# EAGLE board CntrlBoardV3 (EAGLE 8.3.1)
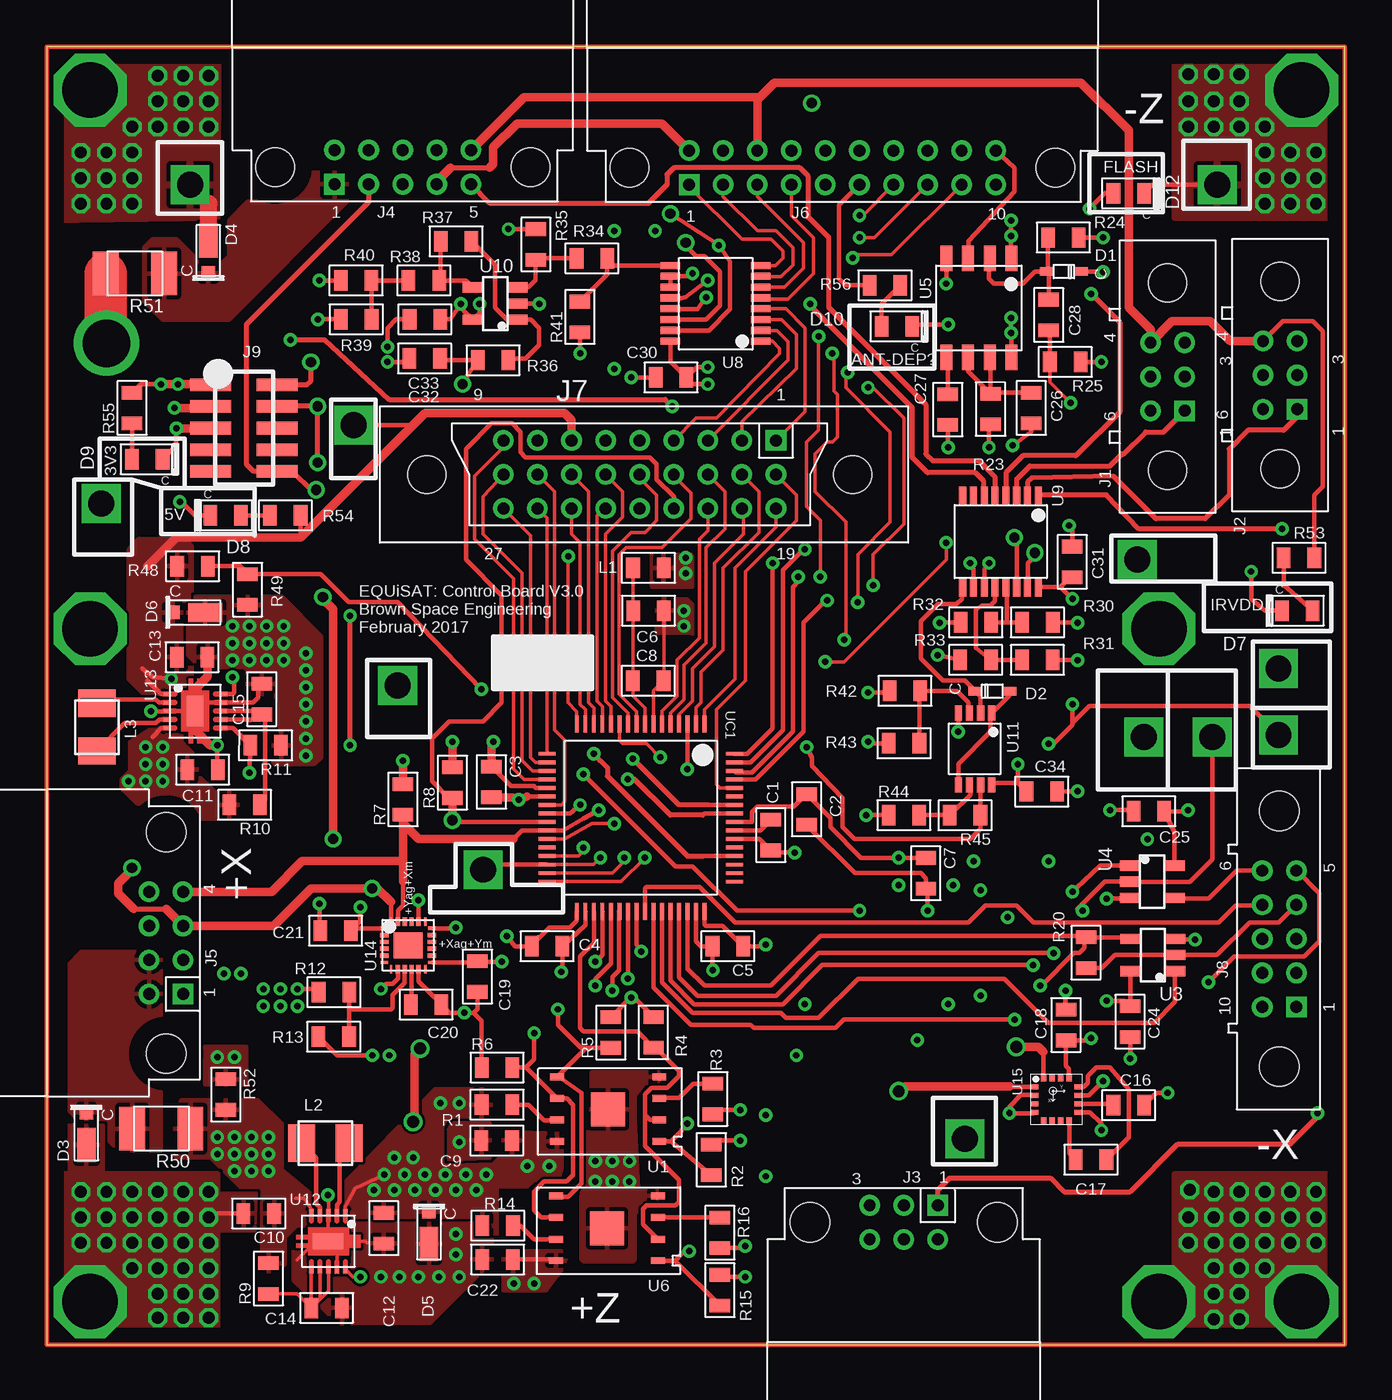
[diagram p8: board, top side]
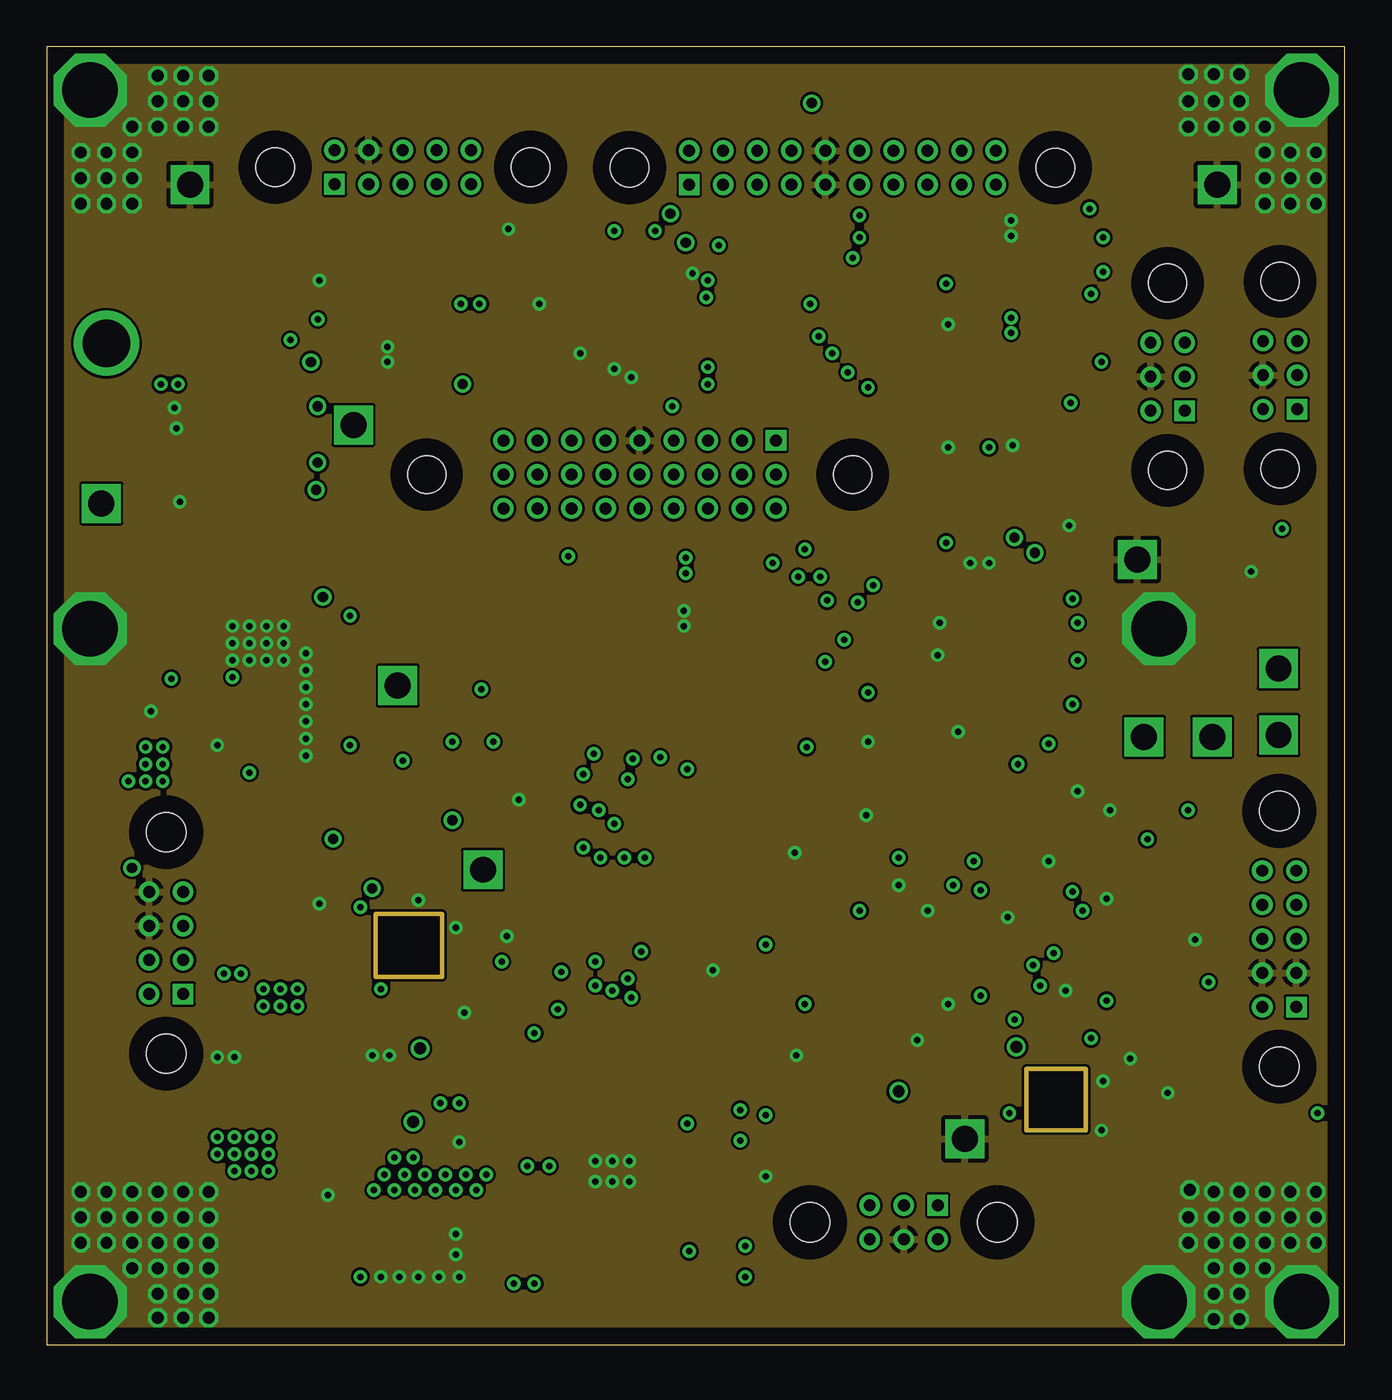
[diagram p9: board, inner layer Route2]
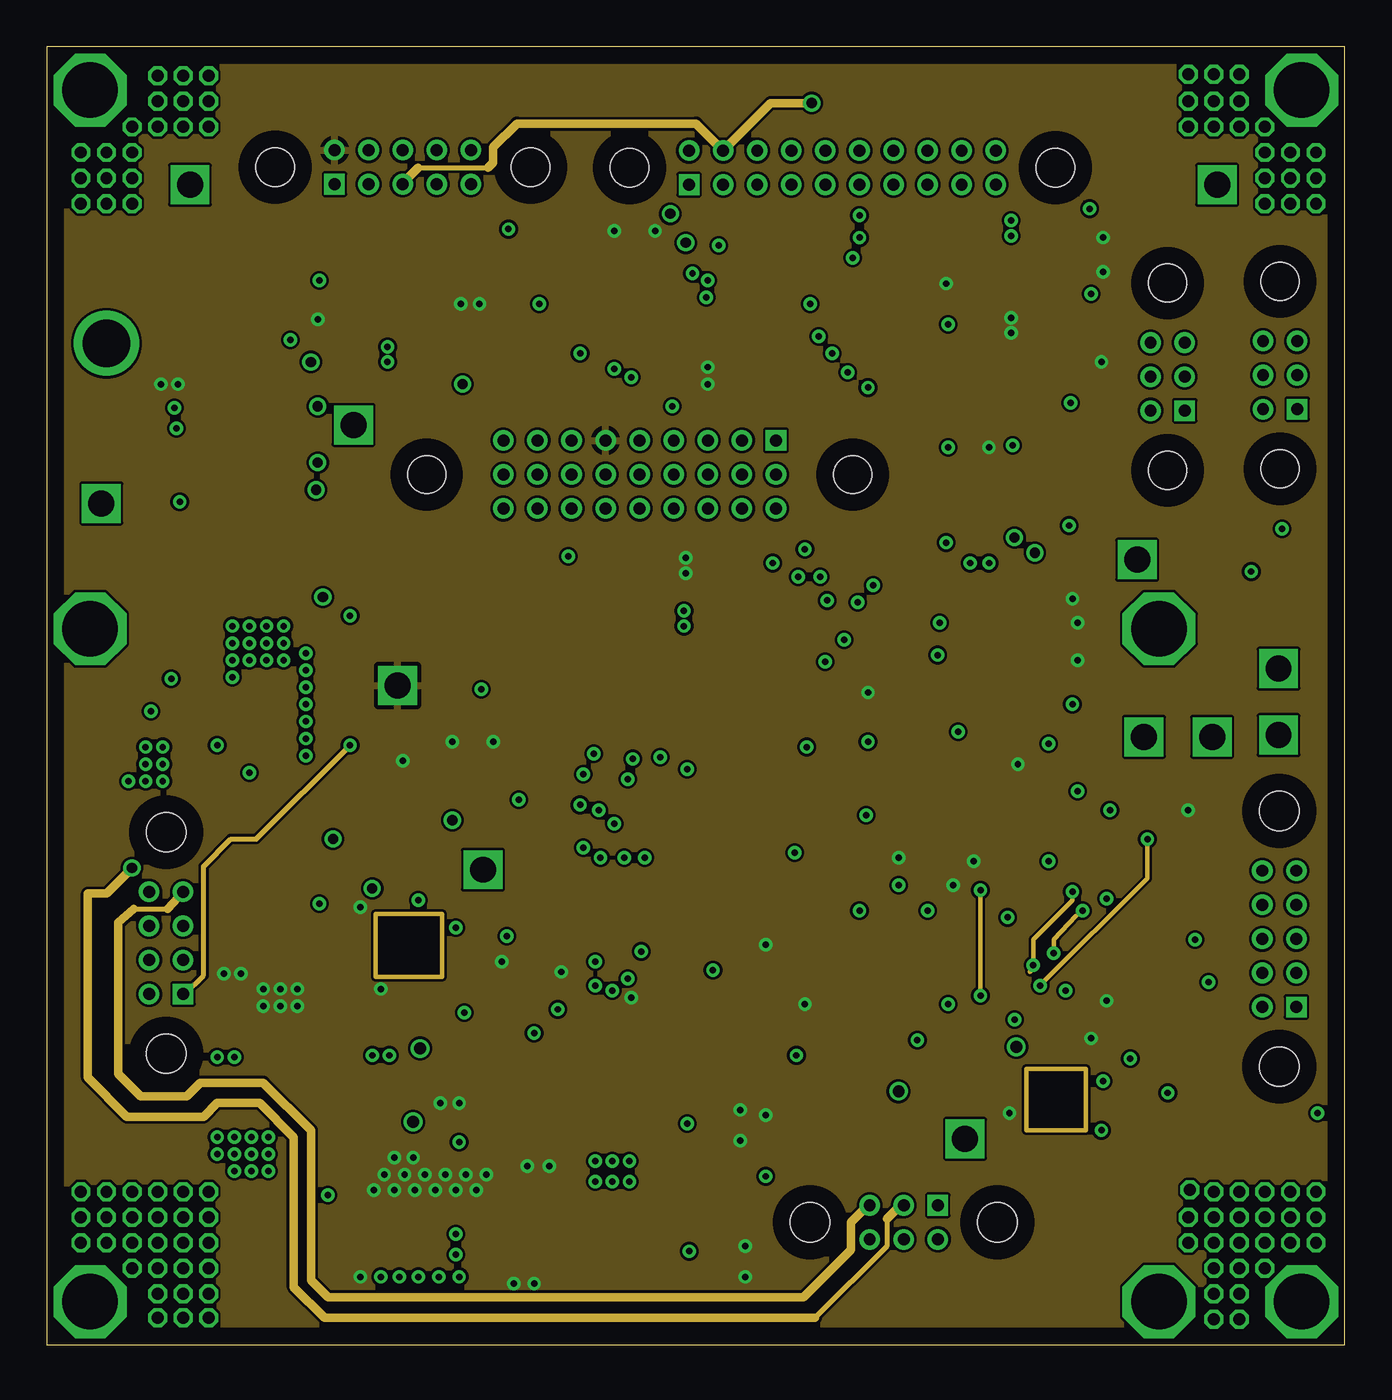
[diagram p10: board, inner layer Route3]
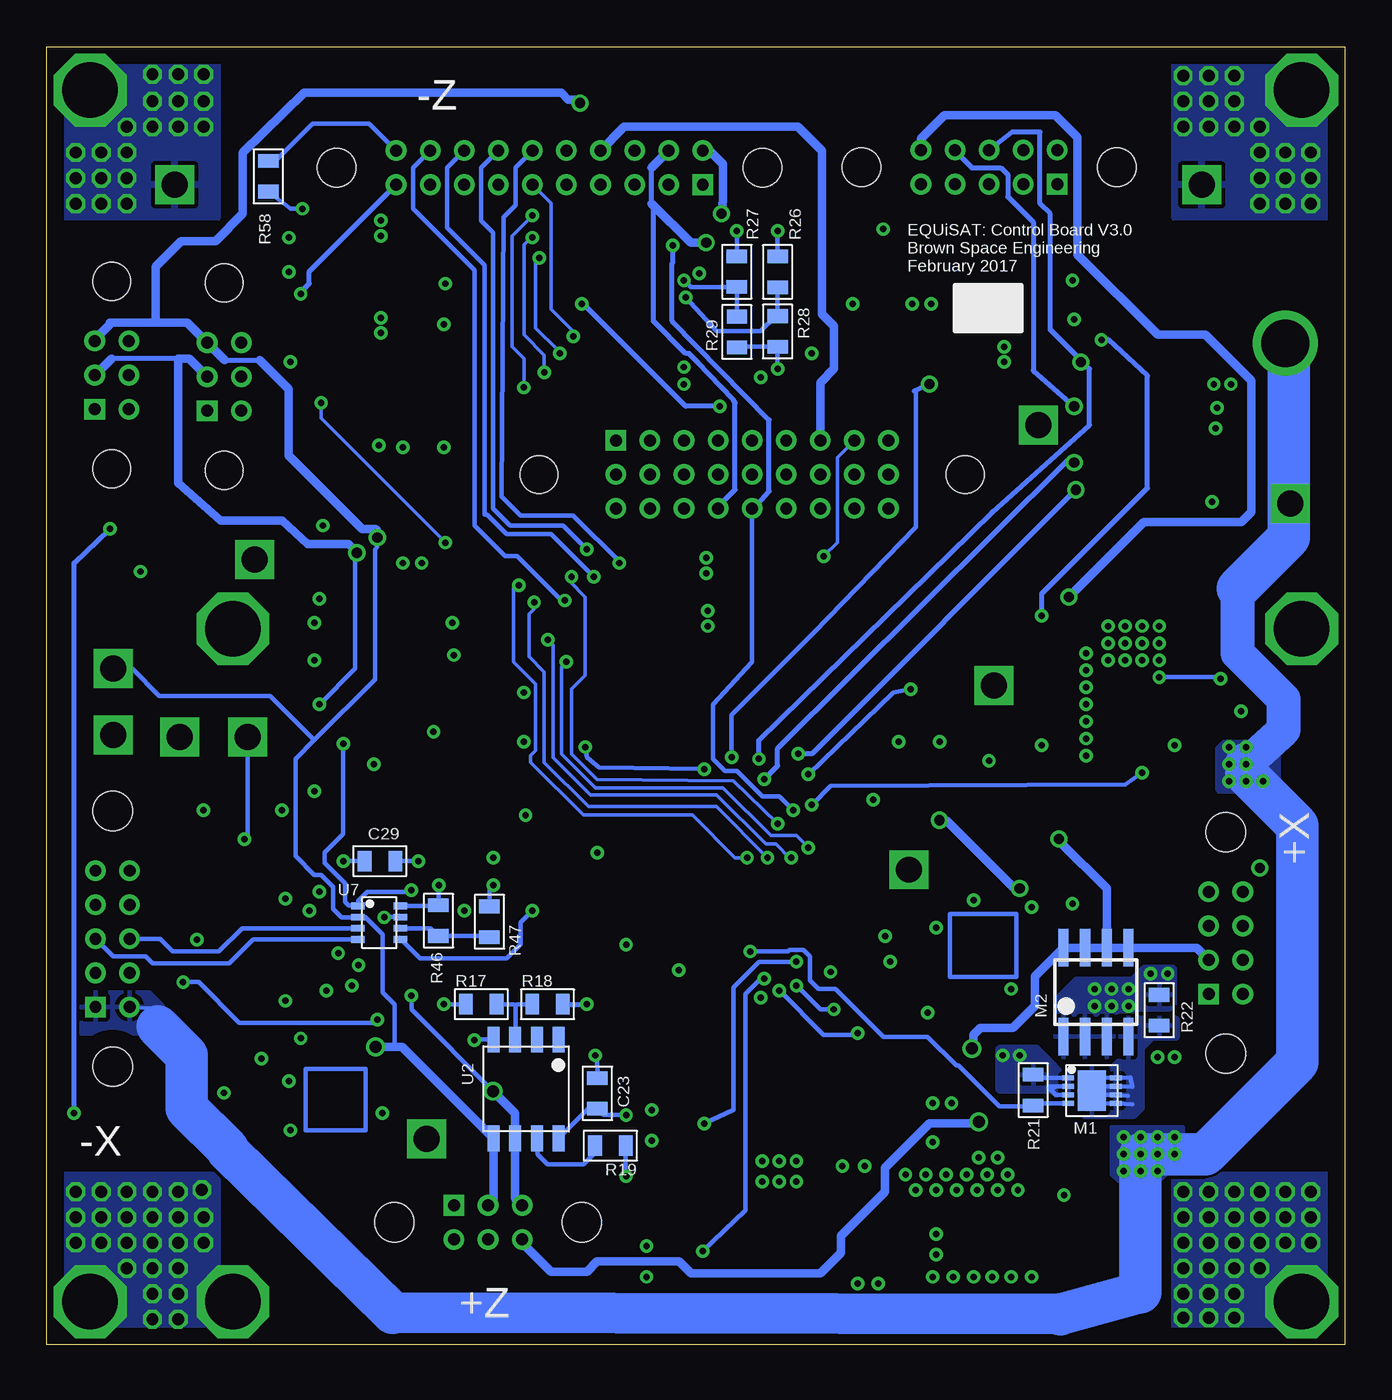
[diagram p11: board, bottom side, seen from below]

Size 76.2 x 76.2 mm. Coordinates in mm from the lower left corner, seen from the top.
Outline: 0,0 76.2,0 76.2,76.2 0,76.2 0,0
Copper layers (1*2*3*16): Top 0.035mm / dielectric 0.2mm / Route2 0.035mm / dielectric 0.2mm / Route3 0.035mm / dielectric 0.2mm / Bottom 0.035mm
Design rules "default *": minimum track width 6mil, minimum drill 15mil, track to track 6mil, track to pad 6mil, pad to pad 6mil, via to via 6mil, smd to smd 6mil, copper to edge 40mil, drill to drill 8mil, minimum pad ring 10mil, minimum via ring 8mil, stop-mask expansion 1mil, vias tented up to drill 0mil, thermal gap 10mil

## Footprints (pad centres in the part's own frame; a part is rotated, then mirrored left to right if it is on the bottom)
0805 = smd 0.8 x 1.2: 1 -0.9,0; 2 0.9,0
SOD-523F = smd 0.5 x 0.8: A 0,-1; C 0,1
MICROSMP = smd 2 x 1.1: A -1.3,0 | smd 0.8 x 0.8: C 0.6,0
0805-D = smd 0.8 x 1.2: A -0.9,0; C 0.9,0
HARWIN_DATAMATE_6 = drill 0.7 square: P$1 -2,-1 | drill 0.7: P$2 0,-1; P$3 2,-1; P$4 2,1; P$5 0,1; P$6 -2,1 | hole 2.2: -5.5,0; 5.5,0
M80-54006 = drill 0.7 square: P$1 0,0 | drill 0.7: P$2 2,0; P$3 4,0; P$4 4,2; P$5 2,2; P$6 0,2 | hole 2.3: -3.5,1; 7.5,1
M80-54010 = drill 0.7 square: P$1 0,0 | drill 0.7: P$2 2,0; P$3 4,0; P$4 6,0; P$5 8,0; P$6 8,2; P$7 6,2; P$8 4,2; P$9 2,2; P$10 0,2 | hole 2.25: -3.5,1; 11.5,1
M80-54008 = drill 0.7 square: P$1 0,0 | drill 0.7: P$2 2,0; P$3 4,0; P$4 6,0; P$5 6,2; P$6 4,2; P$7 2,2; P$8 0,2 | hole 2.3: -3.5,1; 9.5,1
M80-54020 = drill 0.7 square: P$1 -9,-1 | drill 0.7: P$2 -7,-1; P$3 -5,-1; P$4 -3,-1; P$5 -1,-1; P$6 1,-1; P$7 3,-1; P$8 5,-1; P$9 7,-1; P$10 9,-1; P$11 9,1; P$12 7,1; P$13 5,1; P$14 3,1; P$15 1,1; P$16 -1,1; P$17 -3,1; P$18 -5,1; P$19 -7,1; P$20 -9,1 | hole 2.25: -12.5,0; 12.5,0
M83-LMT1M2N27 = drill 0.7 square: P$1 0,0 | drill 0.7: P$2 -2,0; P$3 -4,0; P$4 -6,0; P$5 -8,0; P$6 -10,0; P$7 -12,0; P$8 -14,0; P$9 -16,0; P$10 -16,-2; P$11 -14,-2; P$12 -12,-2; P$13 -10,-2; P$14 -8,-2; P$15 -6,-2; P$16 -4,-2; P$17 -2,-2; P$18 0,-2; P$19 0,-4; P$20 -2,-4; P$21 -4,-4; P$22 -6,-4; P$23 -8,-4; P$24 -10,-4; P$25 -12,-4; P$26 -14,-4; P$27 -16,-4 | hole 2.2: 4.5,-2; -20.5,-2
M80-510 = drill 0.7 square: P$1 0,0 | drill 0.7: P$2 2,0; P$3 4,0; P$4 6,0; P$5 8,0; P$6 8,2; P$7 6,2; P$8 4,2; P$9 2,2; P$10 0,2 | hole 2.3: 11.5,1; -3.5,1
10PINMALE = smd 0.74 x 2.4: P1 -2.54,-1.95; P2 -1.27,-1.95; P3 0,-1.95; P4 1.27,-1.95; P5 2.54,-1.95; P6 2.54,1.95; P7 1.27,1.95; P8 0,1.95; P9 -1.27,1.95; P10 -2.54,1.95
L3225M = smd 1.6 x 2.2: 1 -1.4,0; 2 1.4,0
DFN-3X3-8 = smd 0.3 x 0.7: P$1 -0.75,-1.25; P$2 -0.25,-1.25; P$3 0.25,-1.25; P$4 0.75,-1.25; P$5 0.75,1.55; P$6 0.25,1.55; P$7 -0.25,1.55; P$8 -0.75,1.55 | smd 2.38 x 1.65: PAD 0,0.15
SO08 = smd 0.6 x 2.2: 1 -1.905,-2.6; 2 -0.635,-2.6; 3 0.635,-2.6; 4 1.905,-2.6; 5 1.905,2.6; 6 0.635,2.6; 7 -0.635,2.6; 8 -1.905,2.6
1210 = smd 1.52 x 2.54: P$1 -1.71,0 | smd 1.51 x 2.54: P$2 1.71,0
8PXMO-229 = smd 0.813 x 0.406: P1 -3,1.895; P2 -3,0.635; P3 -3,-0.635; P4 -3,-1.895; P5 3,-1.895; P6 3,-0.635; P7 3,0.635; P8 3,1.895 | smd 2 x 2: P9 0,0
SO-8 = smd 0.7 x 1.5: P$1 -1.905,-2.9; P$2 -0.635,-2.9; P$3 0.635,-2.9; P$4 1.905,-2.9; P$5 1.905,2.9; P$6 0.635,2.9; P$7 -0.635,2.9; P$8 -1.905,2.9
TSOT23-5 = smd 0.6 x 1.2: P$1 -0.95,-1.306; P$2 0,-1.306; P$3 0.95,-1.306; P$4 0.95,1.306; P$5 -0.95,1.306
SOT-23-8 = smd 0.4 x 0.8: P$1 -1.016,-1.27; P$2 -0.366,-1.27; P$3 0.284,-1.27; P$4 0.934,-1.27; P$5 0.934,1.23; P$6 0.284,1.23; P$7 -0.366,1.23; P$8 -1.016,1.23
SSOP-16-NARROW = smd 0.419 x 1.143: P$1 0,0; P$2 0.635,0; P$3 1.27,0; P$4 1.905,0; P$5 2.54,0; P$6 3.175,0; P$7 3.81,0; P$8 4.445,0; P$9 4.445,5.309; P$10 3.81,5.309; P$11 3.175,5.309; P$12 2.54,5.309; P$13 1.905,5.309; P$14 1.27,5.309; P$15 0.635,5.309; P$16 0,5.309
MSOP-8 = smd 0.42 x 0.89: P$1 0,0; P$2 0.65,0; P$3 1.3,0; P$4 1.95,0; P$5 1.95,4.21; P$6 1.3,4.21; P$7 0.65,4.21; P$8 0,4.21
QFN10_POWERPAD = smd 0.203 x 0.406: P$1 0.14,0.241; P$2 0.641,0.241; P$3 1.141,0.242; P$4 1.639,0.239; P$5 2.139,0.242; P$6 2.14,3.559; P$7 1.639,3.559; P$8 1.139,3.555; P$9 0.641,3.555; P$10 0.139,3.558 | smd 1.778 x 0.914: PAD 1.155,1.898
QFN-24-3X3 = smd 0.5 x 0.2: 1 -1.4,1; 6 -1.4,-1; 13 1.4,-1; 18 1.4,1 | smd 0.5 x 0.25: 2 -1.4,0.6; 3 -1.4,0.2; 4 -1.4,-0.2; 5 -1.4,-0.6; 14 1.4,-0.6; 15 1.4,-0.2; 16 1.4,0.2; 17 1.4,0.6 | smd 0.2 x 0.5: 7 -1,-1.4; 12 1,-1.4; 19 1,1.4; 24 -1,1.4 | smd 0.25 x 0.5: 8 -0.6,-1.4; 9 -0.2,-1.4; 10 0.2,-1.4; 11 0.6,-1.4; 20 0.6,1.4; 21 0.2,1.4; 22 -0.2,1.4; 23 -0.6,1.4 | smd 1.7 x 1.54: P 0,0
HMC5883L = smd 0.45 x 0.3: 1 0.225,2.25; 2 0.225,1.75; 3 0.225,1.25; 4 0.225,0.75; 9 2.775,0.75; 10 2.775,1.25; 11 2.775,1.75; 12 2.775,2.25 | smd 0.3 x 0.45: 5 0.75,0.225; 6 1.25,0.225; 7 1.75,0.225; 8 2.25,0.225; 13 2.25,2.775; 14 1.75,2.775; 15 1.25,2.775; 16 0.75,2.775
TQFP-64 = smd 1 x 0.22: P$1 -5.5,3.5; P$2 -5.5,3; P$3 -5.5,2.5; P$4 -5.5,2; P$5 -5.5,1.5; P$6 -5.5,1; P$7 -5.5,0.5; P$8 -5.5,0; P$9 -5.5,-0.5; P$10 -5.5,-1; P$11 -5.5,-1.5; P$12 -5.5,-2; P$13 -5.5,-2.5; P$14 -5.5,-3; P$15 -5.5,-3.5; P$16 -5.5,-4; P$33 5.5,-4; P$34 5.5,-3.5; P$35 5.5,-3; P$36 5.5,-2.5; P$37 5.5,-2; P$38 5.5,-1.5; P$39 5.5,-1; P$40 5.5,-0.5; P$41 5.5,0; P$42 5.5,0.5; P$43 5.5,1; P$44 5.5,1.5; P$45 5.5,2; P$46 5.5,2.5; P$47 5.5,3; P$48 5.5,3.5 | smd 0.22 x 1: P$17 -3.75,-5.75; P$18 -3.25,-5.75; P$19 -2.75,-5.75; P$20 -2.25,-5.75; P$21 -1.75,-5.75; P$22 -1.25,-5.75; P$23 -0.75,-5.75; P$24 -0.25,-5.75; P$25 0.25,-5.75; P$26 0.75,-5.75; P$27 1.25,-5.75; P$28 1.75,-5.75; P$29 2.25,-5.75; P$30 2.75,-5.75; P$31 3.25,-5.75; P$32 3.75,-5.75; P$49 3.75,5.25; P$50 3.25,5.25; P$51 2.75,5.25; P$52 2.25,5.25; P$53 1.75,5.25; P$54 1.25,5.25; P$55 0.75,5.25; P$56 0.25,5.25; P$57 -0.25,5.25; P$58 -0.75,5.25; P$59 -1.25,5.25; P$60 -1.75,5.25; P$61 -2.25,5.25; P$62 -2.75,5.25; P$63 -3.25,5.25; P$64 -3.75,5.25
VIA-60MIL-SQ = drill 1.524 square: P$1 0,0

## Placement (x,y rotation side)
C1  1uF  [0805]  42.5,29.93 270 top
C2  100nF  [0805]  44.6,31.44 270 top
C3  100nF  [0805]  26.1,33.05 270 top
C4  100nF  [0805]  29.36,23.4 180 top
C5  100nF  [0805]  39.97,23.4 180 top
C6  10uF  [0805]  35.32,43.1 0 top
C7  10uF  [0805]  51.6,27.69 270 top
C8  100nF  [0805]  35.3,39 0 top
C9  0.1uF  [0805]  26.41,12 180 top
C10  10uF  [0805]  12.44,7.72 180 top
C11  10uF  [0805]  9.15,33.78 0 top
C12  10uF  [0805]  19.78,6.86 270 top
C13  10uF  [0805]  8.53,40.38 0 top
C14  0.1uF  [0805]  16.42,2.18 0 top
C15  0.1uF  [0805]  12.62,37.91 90 top
C16  4.7uF  [0805]  63.5,14.08 0 top
C17  22uF  [0805]  61.29,10.88 0 top
C18  0.1uF  [0805]  59.82,18.78 90 top
C19  0.1uF  [0805]  25.28,21.63 270 top
C20  0.1uF  [0805]  22.26,19.98 0 top
C21  0.1uF  [0805]  16.95,24.32 180 top
C22  0.1uF  [0805]  26.46,5.02 180 top
C23  0.1uF  [0805]  43.88,14.77 90 bottom
C24  0.1uF  [0805]  63.58,18.98 270 top
C25  0.1uF  [0805]  64.69,31.32 180 top
C26  1uF  [0805]  57.78,55 270 top
C27  0.01uF  [0805]  52.88,54.91 270 top
C28  0.01uF  [0805]  58.81,60.46 90 top
C29  0.1uF  [0805]  56.65,28.41 180 bottom
C30  0.1uF  [0805]  36.64,56.79 0 top
C31  0.1uF  [0805]  60.19,45.97 270 top
C32  0.1uF  [0805]  22.18,57.91 180 top
C33  0.1uF  [0805]  22.19,60.21 180 top
C34  0.1uF  [0805]  58.4,32.49 0 top
D1  1N4148SOD-523F  [SOD-523F]  59.7,63.01 270 top
D2  1N4148SOD-523F  [SOD-523F]  55.5,38.38 90 top
D3  MSP5.0A  [MICROSMP]  2.32,13.05 90 top
D4  MSP5.0A  [MICROSMP]  9.48,63.53 270 top
D5  MSP3V3  [MICROSMP]  22.43,7.23 90 top
D6  MSP5.0A  [MICROSMP]  8,43 180 top
D7  LED0805  [0805-D]  73.4,43.1 180 top
D8  LED0805  [0805-D]  10.5,48.7 180 top
D9  LED0805  [0805-D]  5.9,52 0 top
D10  LED0805  [0805-D]  49.9,59.8 0 top
D12  LED0805  [0805-D]  63.5,67.6 0 top
J1  HARWIN_06  [HARWIN_DATAMATE_6]  65.79,56.84 90 top
J2  HARWIN_06  [HARWIN_DATAMATE_6]  72.39,56.93 90 top
J3  M80-54006  [M80-54006]  52.3,8.2 180 top
J4  M80-54010  [M80-54010]  16.89,68.14 0 top
J5  M80-54008  [M80-54008]  8,20.6 90 top
J6  M80-54020  [M80-54020]  46.7,69.11 0 top
J7  M83-LMT1M2N27  [M83-LMT1M2N27]  42.8,53.1 0 top
J8  M80-5101005  [M80-510]  73.34,19.84 90 top
J9  M50-3600542  [10PINMALE]  11.57,53.82 270 top
L1  BLM21PG221SN1D  [0805]  35.31,45.61 180 top
L2  2.2uH  [L3225M]  16.35,11.85 0 top
L3  3.3uH  [L3225M]  2.95,36.27 90 top
M1  AON7522E  [DFN-3X3-8]  15,14.93 270 bottom
M2  SI4427BDY-T1-E3CT-ND  [SO08]  14.62,20.71 0 bottom
R1  10K  [0805]  26.42,14.11 180 top
R2  10K  [0805]  39.01,10.87 90 top
R3  10K  [0805]  39.09,14.44 270 top
R4  10K  [0805]  35.61,18.35 90 top
R5  10K  [0805]  33.11,18.34 90 top
R6  10K  [0805]  26.43,16.29 0 top
R7  3K3  [0805]  20.91,32.02 90 top
R8  3K3  [0805]  23.81,33.01 90 top
R9  100R  [0805]  13.01,3.9 90 top
R10  100R  [0805]  11.61,31.71 180 top
R11  10K  [0805]  12.84,35.2 180 top
R12  10K  [0805]  16.85,20.7 180 top
R13  10K  [0805]  16.84,18.1 0 top
R14  10K  [0805]  26.47,7 180 top
R15  10K  [0805]  39.5,3.22 90 top
R16  10K  [0805]  39.5,6.59 270 top
R17  [0805]  50.7,20 0 bottom
R18  [0805]  46.81,20 0 bottom
R19  [0805]  43.12,11.7 180 bottom
R20  0R  [0805]  61,23.03 270 top
R21  1K  [0805]  18.3,14.96 90 bottom
R22  100R  [0805]  10.9,19.65 90 bottom
R23  91K  [0805]  55.4,54.94 90 top
R24  10K  [0805]  59.67,65 180 top
R25  10K  [0805]  59.78,57.7 180 top
R26  10K  [0805]  33.3,62.99 90 bottom
R27  10K  [0805]  35.7,63 90 bottom
R28  10K  [0805]  33.3,59.49 90 bottom
R29  10K  [0805]  35.69,59.46 90 bottom
R30  10K  [0805]  58.15,42.41 0 top
R31  10K  [0805]  58.14,40.21 0 top
R32  10K  [0805]  54.53,42.41 0 top
R33  10K  [0805]  54.52,40.21 0 top
R34  10K  [0805]  31.99,63.79 180 top
R35  91K  [0805]  28.71,64.6 270 top
R36  100K  [0805]  26.19,57.81 0 top
R37  91K  [0805]  24.02,64.79 180 top
R38  10K  [0805]  22.13,62.49 180 top
R39  3.3K  [0805]  18.16,60.21 0 top
R40  220  [0805]  18.15,62.49 180 top
R41  1K  [0805]  31.29,60.34 90 top
R42  10K  [0805]  50.37,38.39 180 top
R43  10K  [0805]  50.32,35.31 0 top
R44  10K  [0805]  50.31,31.11 0 top
R45  10K  [0805]  53.9,31.09 180 top
R46  10K  [0805]  53.21,24.91 270 bottom
R47  10K  [0805]  50.22,24.84 270 bottom
R48  21K  [0805]  8.55,45.72 0 top
R49  10K  [0805]  11.78,44.34 90 top
R50  0R  [1210]  6.72,12.7 180 top
R51  0R  [1210]  5.17,62.9 180 top
R52  10M  [0805]  10.5,14.7 270 top
R53  330R  [0805]  73.5,46.2 0 top
R54  560R  [0805]  14,48.7 0 top
R55  330R  [0805]  5,55 90 top
R56  560R  [0805]  49.2,62.2 180 top
R58  330R  [0805]  63.2,68.6 270 bottom
U1  MR25H40MDF  [8PXMO-229]  32.95,13.84 180 top
U2  M24M02-DR  [SO-8]  48.07,15.03 180 bottom
U3  SN74LVC1G125  [TSOT23-5]  64.92,22.89 90 top
U4  SN74LVC1G125  [TSOT23-5]  64.88,27.19 270 top
U5  [SO-8]  54.71,60.87 180 top
U6  MR25H40MDF  [8PXMO-229]  32.88,6.85 180 top
U7  AD7991-1  [SOT-23-8]  56.67,24.75 270 bottom
U8  LTC1380-GN  [SSOP-16-NARROW]  41.91,58.92 90 top
U9  LTC1380-GN  [SSOP-16-NARROW]  58.2,49.81 180 top
U10  LT6015  [TSOT23-5]  26.32,61.13 90 top
U11  LT6016  [MSOP-8]  55.46,37.09 180 top
U12  TPS63001  [QFN10_POWERPAD]  17.67,7.99 180 top
U13  TPS63002  [QFN10_POWERPAD]  6.81,38.35 270 top
U14  MPU9250  [QFN-24-3X3]  21.21,23.46 0 top
U15  HMC5883L  [HMC5883L]  57.76,12.91 0 top
UC1  SAMD21JTQFP-64  [TQFP-64]  35.11,30.95 270 top
V1  RX_DATA  [VIA-60MIL-SQ]  64.4,35.7 90 top
V2  TX_DATA  [VIA-60MIL-SQ]  68.4,35.7 90 top
V3  VIN  [VIA-60MIL-SQ]  3.2,49.4 180 top
V4  SDA  [VIA-60MIL-SQ]  72.3,39.7 0 top
V5  SCL  [VIA-60MIL-SQ]  72.3,35.8 0 top
V6  ANT_DRV1  [VIA-60MIL-SQ]  25.6,27.9 90 top
V9  GND  [VIA-60MIL-SQ]  64,46.1 0 top
V10  GND  [VIA-60MIL-SQ]  8.4,68.1 0 top
V11  GND  [VIA-60MIL-SQ]  68.7,68.1 0 top
V12  GND  [VIA-60MIL-SQ]  53.9,12.1 0 top
V13  3V3  [VIA-60MIL-SQ]  20.6,38.7 90 top
V14  5V  [VIA-60MIL-SQ]  18,54 90 top

## Tracks (layer width: path | path; a pad name or v marks a point on that pad's centre or on a via)
3V3REF
  Bottom 0.25: U7.P$6 53.67,24.47 R46.2 50.29,24.01 R47.2
3V6_REF
  Bottom 0.25: U7.P$3 64.73,24.47 66.1,23.1 68.8,23.1 69.54,23.84 J8.P$8
3V6_SNS
  Bottom 0.25: U7.P$4 64.08,23.82 65.5,22.4 70,22.4 70.4,22.8 72.3,22.8 J8.P$3
5V_EN  (via drill 0.38)
  Top 0.25: UC1.P$24 30.7,31.2 v31.3,31.7 | v11.9,33.6 11.94,35 R11.2 10.93,36.21 U13.P$6
  Bottom 0.25: v11.9,33.6 12.9,32.9 30.2,32.8 v31.3,31.7
5VREF  (via drill 0.38)
  Top 0.25: R48.2 11.36,45.72 R49.2 16.06,45.24 17.7,43.6 20.6,43.6 v25.5,38.5 | v47.7,25.5 40.5,25.5 37.9,28.1 36.9,28.1 v31.5,33.5
  Bottom 0.25: v25.5,38.5 26.5,38.3 v31.5,33.5 | v47.7,25.5 48.4,24.8 48.4,23.5 49.2,22.7 54.3,22.7 55.42,23.82 U7.P$5
!CS2!  (via drill 0.38)
  Top 0.25: R15.1 36.87,4.96 | U6.P1 36.87,4.96 | 36.87,4.96 37.31,5.4 37.7,5.4 v37.7,5.5 | v34.1,21.5 34.11,21.81 UC1.P$39
  Bottom 0.25: v37.7,5.5 35.2,7.9 35.2,20.6 34.3,21.5 v34.1,21.5
!CS!  (via drill 0.38)
  Top 0.25: R2.1 36.63,11.95 | U1.P1 36.63,11.95 | 36.63,11.95 37.19,12.5 v37.6,13 | v32.2,22.5 32.61,22.91 UC1.P$36
  Bottom 0.25: v37.6,13 35.9,13.8 35.9,21 34.4,22.5 v32.2,22.5
!LED_CMD!  (via drill 0.38)
  Top 0.2: UC1.P$29 31.2,28.7 31.4,28.9 31.4,29.2 v31.5,29.2 | v45.7,40.1 46.8,40.1 52.8,46.1 v52.8,47.1 | v52.8,47.1 52.8,47.3 v52.8,47.1 | v60.1,55.3 58.88,56.52 R25.2
  Top 0.25: R25.2 58.88,59.49 C28.1
  Bottom 0.2: v31.5,29.2 32.2,29.9 33.7,29.9 36.5,32.7 44,32.7 46,34.7 46,36.6 46,39.8 45.8,40 v45.7,40.1 | v52.8,47.1 60.1,54.4 v60.1,55.3
!RAD_SHDN!  (via drill 0.38)
  Top 0.25: UC1.P$42 35.61,20.99 37.8,18.8 41.3,18.8 41.5,18.6 46.3,18.6 46.8,19.1 v56.8,19.1 | v68.2,21.3 69.7,22.8 73.8,22.8 74.7,23.7 74.7,26.5 73.36,27.84 J8.P$5
  Bottom 0.25: v56.8,19.1 57,18.9 64.9,18.9 67.3,21.3 v68.2,21.3
!RESET!  (via drill 0.38, 0.6)
  Top 0.25: 38.5,28.7 UC1.P$52
  Top 0.3: J4.P$2 18.89,67.09 11.7,59.9 11.7,51.7 12.1,51.3 13.5,51.3 J9.P6 13.6,51.2 14.5,51.2 15.5,50.2 v15.8,50.2 | v32.1,34.7 32.9,33.9 32.9,33.4 37.6,28.7 38.5,28.7
  Bottom 0.3: v15.8,50.2 31.3,34.7 v32.1,34.7
+3V3  (via drill 0.38)
  Top 0.2: U12.P$1 17.5,7.78 17.5,8.1 18.1,9.2 v19.8,10 | v18.4,4 17.96,4 U12.P$10
  Top 0.25: U6.P8 29.82,5.02 C22.1 | R15.2 39.62,4 v41,4 | v41,5.8 40.79,5.69 R16.2 | R2.2 38.84,12 v40.7,12 | R3.2 38.85,13.8 v40.7,13.8 | R1.2 25.43,14.2 | R4.2 34.46,20.4 v34.3,20.4 34.27,20.4 R5.2 | UC1.P$34 31.61,24.65 C4.1 30.26,21.96 v30.2,21.9 | R12.2 15.75,20.9 v14.7,20.9 | v18.4,25.7 18.4,24.87 C21.1 17.99,24.46 U14.1 | v19.6,20.9 19.9,21.2 20.3,21.2 20.61,21.51 U14.8 | U14.13 25.21,22.46 C19.1 25.31,22.5 v26.7,22.5 | UC1.P$21 28.7,32.7 28.6,32.8 27.25,32.8 C3.1 | U15.13 60,16.2 59.82,16.38 C18.1 61.18,17.88 v61.3,18 | U15.2 57.19,14.67 56.5,13.98 v56.5,13.6 57.92,13.6 U15.4 | v62.2,20.2 63.26,20.2 C24.1 63.61,19.91 U3.P$5 | v67,31.4 66.98,31.32 C25.1 66.19,30.12 U4.P$5 | 57,32.99 C34.1 | 57,32.99 v57,34.1 | U11.P$8 55.57,32.99 57,32.99 | UC1.P$48 38.61,24.69 38.7,24.6 39.67,24.6 C5.1 | 41.17,23.1 C5.1 | v42.2,23.5 42.27,23.4 C5.1 | UC1.P$56 41.4,30.7 41.4,31.3 41.7,31.6 43.86,31.6 C2.1 46,30.94 46,30.4 47.8,28.6 v50,28.6 50.21,28.59 C7.1 | v48.2,38.3 49.38,38.3 R42.2 | R30.2 v60.49,42.41 v60.5,42.4 | R31.2 v60.49,40.21 v60.5,40.2 | 59.5,44.5 U9.P$16 | 59.5,44.5 v60.2,43.8 | C31.2 60.07,45.07 59.5,44.5 | v55.3,52.7 55.3,53.94 R23.1 | U5.P$8 56.62,59.38 v56.6,59.4 v56.6,60.3 | R25.1 v61.9,57.7 | D1.C v61.99,63.01 v62,63 | R24.1 v62,65 | v52.8,62.3 U5.P$4 | R39.1 v15.91,60.21 v15.9,60.2 | v25.4,61.1 25.4,60.57 U10.P$5 24.5,60.69 v24.3,61.1 23.71,60.21 C33.1 | C30.2 37.93,56.4 v38.8,56.4 | C30.2 38.15,57.4 v38.8,57.4 | C30.2 36.6,57.73 U8.P$16 | R55.2 5.5,56.4 v6.7,56.4
  Top 0.51: R7.2 v20.91,34.29 v20.9,34.3 | R8.2 v23.81,35.39 v23.8,35.4 | C3.1 26.1,35.3 v26.2,35.4 | J9.P1 9.58,56.4 v7.7,56.4 v6.7,56.4
  Bottom 0.25: v42.2,13.5 43.51,13.5 C23.1 44.42,13.87 U2.P$8 | R27.2 v35.7,65.4 | R26.2 v33.3,65.4 | v53.2,27 v53.21,26.99 R46.1 53.25,25.77 U7.P$8 | C29.1 55.64,28.4 v54.4,28.4
  Bottom 0.3: R18.2 v44.5,20
  other vias: 19.2,9.1 20.4,9.1 21.6,9.1 20.4,11 22.8,9.1 24,9.1 24.6,10 23.4,10 21.5,11 22.2,10 21,10 28.6,3.6 27.4,3.6 28.2,10.5 29.5,10.5 25.2,9.1 25.8,10 12.7,19.9 13.7,19.9 14.7,19.9 13.7,20.9 12.7,20.9 10.4,21.8 11.4,21.8 37.5,46.2 37.5,45.3 24.2,14.2 23.1,14.2
  pour Route3: -5.8,84 77.8,84 77.8,-4 -7.5,-4 -7.5,84.1 -5.8,84.1
  pour Top (rank 2): 17.2,7 17.2,9.2 22.8,15 26,15 26.4,9.2 26.4,6.2 26.2,7.3 18.4,7.3 18.3,7.2
  pour Top: 35.5,46.4 35.5,44.5 37.9,44.5 37.9,46.3 37.8,46.4
  pour Top: 26.8,3.2 29.3,3.2 30.2,4.4 30.5,5.2 30.2,5.5 26.9,5.5 26.8,5.4
  pour Top: 26.4,9.3 28.2,9.3 28.6,9.7 30,9.7 30.2,10.4 30.2,12.3 30.1,12.4 26.9,12.5 26.8,12.4 26.8,11.2 26.1,10.5 26.1,9.6
  pour Bottom: 12.5,19.6 13.3,19.6 13.6,19.3 13.6,17.1 13.8,16.9 16.6,16.9 17,17.3 17,20.3 15.8,21.5 12.5,21.5 11.8,22.2 10.1,22.2 10,22.1 10,20 10.3,19.7 12.3,19.7 12.4,19.6
+5V  (via drill 0.38)
  Top 0.25: U13.P$10 10.91,38.21 11,38.3 11,39.1 v10.9,39.2 | v7.3,39.1 6.2,39.2 5.6,39.7 | U13.P$1 6.91,38.21 6.7,38.2 5.9,39 | 14.9,47.4 R54.2 | V14.P$1 21.5,54
  Top 0.51: J7.P$7 30.8,54.3 30.4,54.7 22.2,54.7 21.5,54 14.9,47.4 7.6,47.4 5.9,45.7
  Bottom 0.25: v10.9,39.2 7.6,39.2 v7.3,39.1
  Bottom 0.51: J7.P$7 30.8,56.5 30,57.3 30,59.8 30.7,60.5 30.7,70.1 32.1,71.5 42.31,71.5 J6.P$17
  pour Top (rank 6): 7.4,38 5.9,38 4.8,39.1 4.8,46.7 5.4,47.3 8.1,47.3 8.5,46.9 8.5,39.1
A0_0  (via drill 0.38)
  Top 0.25: v38.7,61.5 38.2,60.8 36.63,60.8 U8.P$13
  Bottom 0.25: R26.1 R28.2 33.41,60.39 34.3,59.5 36.9,59.5 v38.7,61.5
A0_1
  Top 0.25: 56.36,42.41 R30.1 | 56.36,42.41 R32.2 | U9.P$13 56.36,44.44 56.36,42.41
A1_0  (via drill 0.38)
  Top 0.25: U8.P$12 37.24,61.46 37.5,61.5 v38.8,62.5
  Bottom 0.25: v38.8,62.5 38.4,62.1 R27.1 R29.2
A1_1
  Top 0.25: R31.1 R33.2 54.53,40.9 54.53,43.17 54.9,43.4 55.4,43.4 55.66,43.66 U9.P$12
AD0
  Top 0.25: R13.2 17.75,19.7 | 17.75,19.7 R12.1 | U14.9 21.01,21.25 20.3,20.54 20.3,19.8 20.2,19.7 17.75,19.7
ANT_DRV1  (via drill 0.38)
  Top 0.2: J6.P$9 49.59,64 47.4,64 47.3,63.9 v47.3,63.8 | v46.1,58.2 46.2,58.1 46.2,56 46.4,55.8 46.4,53.3 46.1,53 45.8,53 45.1,52.3 45.1,50.1 46.9,48.3 46.9,41.6 46.8,41.5 v46.8,41.4 | v32.5,28.6 32.1,28.2 UC1.P$30
  Top 0.25: UC1.P$30 26.3,28.2 V6.P$1
  Bottom 0.2: v47.3,63.8 47.5,63.6 47.5,59.7 46.2,58.4 46.2,58.1 v46.1,58.2 | v46.8,41.4 46.5,41.1 46.5,34.5 44.3,32.3 36.9,32.3 34,29.4 33.4,29.4 32.6,28.6 v32.5,28.6
ANT_DRV2  (via drill 0.38)
  Top 0.2: UC1.P$31 33.2,27.7 33.9,28.4 v33.9,28.6 | v47.6,43.6 47.6,46.4 49.5,48.3 49.5,53.6 46.9,56.2 46.9,57.1 47,57.2 v47,57.1 | v47.7,65 48.59,65 J6.P$8
  Bottom 0.2: v47.6,43.6 47.6,43.2 47.9,42.9 47.9,40.4 47,39.5 47,34.2 44.4,31.6 36.9,31.6 v33.9,28.6 | v47,57.1 47,58.1 48.2,59.3 48.2,64.6 47.7,65.1 v47.7,65
ANT_DRV3  (via drill 0.38)
  Top 0.2: UC1.P$32 33.7,27.2 v35.1,28.6 | v48.5,44.6 48.5,46.4 50.3,48.2 50.3,54.4 48.4,56.3 48.3,56.3 v48.2,56.2 | v47.7,66.3 47.89,66.3 J6.P$7
  Bottom 0.2: v35.1,28.6 35.8,28.6 38.3,31.1 44.7,31.1 47.8,34.2 47.8,34.6 47.5,34.9 47.5,38.8 48.8,40.1 48.8,44.4 48.6,44.6 v48.5,44.6 | v48.2,56.2 48.2,57.9 48.9,58.6 48.9,65.1 v47.7,66.3
DET_RTN  (via drill 0.38)
  Top 0.2: UC1.P$27 30.4,29.7 32,30.6 v33.3,30.6 | v45.4,45.1 45.4,48.4 44.6,49.2 44.6,53 45.3,53.7 v45.3,59.2
  Top 0.25: J6.P$6 46.5,66.91 46.5,62.6 46.9,62.2 R56.2
  Bottom 0.2: v33.3,30.6 35.9,33.1 43.9,33.2 45.4,34.7 45.4,38.5 44.6,39.3 44.6,43.9 45.5,44.8 45.5,45 v45.4,45.1 | v45.3,59.2 45.3,59.5 46.6,60.8 46.6,67.01 J6.P$6
GND  (via drill 0.38, 0.7, 3.26)
  Top 0.2: UC1.P$7 35.61,38.41 C8.2 36.22,39.02 C6.2 | U12.P$9 17.03,5.58 U12.PAD | U12.PAD 16.52,7.74 U12.P$3 16.53,8.77 v16.5,8.8 | U12.PAD 15.79,6.09 14.7,5 | U12.PAD 18.71,6.09 18.8,6
  Top 0.25: UC1.P$33 31.1,24.9 30.7,24.5 29.5,24.5 28.86,23.86 | 28.86,23.86 C4.2 27.47,23.41 v27,24 | R13.1 17.04,17 v19.1,17 | C21.2 16,24.37 v16,25.9 | U14.20 v21.81,26.09 v21.8,26.1 | U14.18 23.96,24.46 v24,24.5 | U14.11 21.81,21.33 C20.2 23.64,19.5 v24.5,19.5 25.06,19.5 | C19.2 25.28,19.72 25.06,19.5 | UC1.P$22 28.2,32.2 | C11.2 10,33.83 v10,35.2 | C15.2 12.4,38.59 12.4,38 12.11,37.71 U13.P$9 9.22,37.71 U13.PAD 8.7,37.21 U13.P$3 v6.1,37.2 | U15.11 61.17,14.66 61.9,15.39 v62,15.5 | U15.9 60.55,13.67 61.23,13.67 61.9,13 v61.9,12.6 | C16.2 65.12,14.8 v65.8,14.8 | C18.2 59.8,19.7 v59.8,20.8 | C24.2 63.6,18.06 v63.6,16.8 | U3.P$3 66.27,23.8 v67.4,23.8 | U4.P$3 63.53,26.2 v62.2,26.2 | C25.2 63.87,31.4 v62.4,31.4 | v60.5,32.5 v60.49,32.49 C34.2 | R44.1 v48.1,31.1 | v39.1,22 39.07,22.37 C5.2 38.4,23.4 38.1,23.7 UC1.P$47 | UC1.P$54 41.83,29.7 C1.2 42.63,28.9 v43.9,28.9 | 50.21,26.79 v50,27 | R43.1 48.29,35.31 v48.2,35.4 | v53.5,36 U11.P$4 | U9.P$11 55.02,45.52 v55.3,45.9 | U9.P$10 54.39,45.51 v54.2,45.9 | R32.1 v52.41,42.41 v52.4,42.4 | v52.3,40.5 R33.1 | C31.1 60.19,47.91 v60,48.1 | v56.7,52.8 57.8,53.62 C26.2 | v52.9,52.7 52.9,53.99 C27.2 | v56.6,66 v56.6,65.1 56.6,63.78 U5.P$1 | R40.2 v16.01,62.49 v16,62.5 | C33.2 20.51,60.21 20,59.7 v20,58.6 | C32.2 21.07,57.7 v20,57.7 | R35.1 v27.1,65.5 | R41.1 v31.3,58.2 | v28.9,61.1 28.87,61.13 U10.P$2 | v34.3,56.8 v34.31,56.79 C30.1 | 36.63,62.7 U8.P$10 | U8.P$11 U8.P$10 | v51.7,25.5 51.7,26.69 C7.2 51.6,27.4 51.3,27.7 47.44,27.7 C2.2 | U8.P$10 37.73,62.73 v37.9,62.9 | 28.8,23.92 28.86,23.86 | C10.2 9.72,7.72 v9.5,7.5 | D12.C 64.9,68.1 V11.P$1 | D10.C 50.9,59.9 v52.9,59.9 53,59.9 | D8.C 8.7,48.7 7.9,49.5 v7.8,49.5
  Top 0.25: D9.C 7.6,52.8 v7.6,53.8 | D7.C 71.5,43.1 70.7,43.8 v70.7,45.4 | 9.5,67 V10.P$1 | R6.1 25.53,19.03 25.06,19.5
  Top 0.51: C3.2 27.35,32.15 v27.7,32 28.2,32.2 | C13.2 9.43,39.23 8.8,38.6 8.8,37.29 U13.PAD | v10,35.2 9.6,35.2 8.7,36.1 U13.PAD 8.7,37.21 | J9.P2 9.53,55 v7.5,55 | J9.P3 9.6,53.8 v7.6,53.8
  Top 1: 9.5,67 9.48,66.98 D4.A
  Bottom 0.25: M1.P$1 18.12,15.68 R21.2 | M1.P$2 17.32,15.18 17.4,15.1 | 17.4,15.1 17.1,15.1 | M1.P$3 16.98,14.68 17.4,15.1 | v51.1,17.9 51.07,17.93 U2.P$4 | R17.1 v52.9,20 | C23.2 43.9,16.85 v44,17 | v42.2,9.9 42.22,10.62 R19.1 | v33.3,57.3 R28.1 35.66,58.59 R29.1 | R47.1 50.22,26.78 v50,27 | U7.P$7 56.38,25.12 v56.4,25.1 | C29.2 v58.81,28.41 v58.8,28.4
  other vias: 2.54,2.54 2.54,42.04 65.28,42.04 65.28,2.54 73.66,2.54 73.66,73.66 2.54,73.66 68.5,1.5 70,1.5 70,3 68.5,3 68.5,4.5 70,7.5 70,4.5 70,6 68.5,6 67,6 71.5,4.5 71.5,6 73,6 74.5,6 68.5,7.5 67,7.5 67.1,9.1 68.5,9 9.5,1.6 8,1.6 6.5,1.6 6.5,3 8,3 9.5,3 9.5,4.5 8,4.5 6.5,4.5 5,4.5 9.5,6 8,6 6.5,6 5,6 3.5,6 2,6 8,7.5 6.5,7.5 5,7.5 3.5,7.5 2,7.5 2,9 3.5,9 5,9 6.5,9 8,9 9.5,9 9.5,74.5 9.5,73 9.5,71.5 5,67 3.5,67 2,67 2,68.5 3.5,68.5 5,68.5 5,70 3.5,70 2,70 5,71.5 6.5,71.5 8,71.5 8,73 6.5,73 6.5,74.5 8,74.5 67,74.6 67,73 67,71.5 71.5,67 73,67 74.5,67 74.5,68.5 73,68.5 71.5,68.5 71.5,70 73,70 74.5,70 71.5,71.5 70,71.5 68.5,71.5 68.5,73 70,73 70,74.6 68.5,74.6 10,16.9 11,16.9 24,5.3 24,6.5 74.5,7.5 73,7.5 71.5,7.5 74.5,9 73,9 71.5,9 70,9 32.2,9.6 33.2,9.6 34.2,9.6 24.2,11.9 33.2,10.8 34.2,10.8 32.2,10.8 37.4,43.1 37.4,42.2 10.9,42.2 11.9,42.2 12.9,42.2 10.9,41.2 10.9,40.2 11.9,40.2 11.9,41.2 12.9,41.2 12.9,40.2 13.9,42.2 13.9,41.2 13.9,40.2 15.2,34.6 15.2,35.6 15.2,36.6 15.2,37.6 15.2,38.6 15.2,39.6 15.2,40.6 20.1,17 20.7,4 21.8,4 23,4 24.2,4 19.6,4
  pour Route2: -5.3,83.4 80.1,83.4 80.1,-5.6 -5.3,-5.6
  pour Top: 10,-10.1 10,10 -12.3,10 -12.3,-10.1
  pour Top: 86.6,66.2 86.6,88.7 66.2,88.7 66.2,66.2
  pour Top: 85.9,-9.1 85.9,10 66.2,10 66.2,-9.1
  pour Top (rank 3): 10,66.2 10.1,77.4 -3.5,76.9 -4.2,66
  pour Bottom: 10,66.2 10,91.4 -16.1,91.4 -16.1,66.2
  pour Bottom: 89.7,66.2 89.7,91.4 66.2,91.4 66.2,66.2
  pour Bottom: 89.7,-15.2 89.7,10 66.2,10 66.2,-15.2
  pour Bottom: 10,-15.2 10,10 -16.1,10 -16.1,-15.2
  pour Top: 22.5,1.3 17.1,1.3 14.5,3.8 14.5,7 14.7,7.1 26.1,7.1 26.1,4.9
  pour Top: 37.9,41.7 37.9,43.5 37.6,43.8 36,43.8 35.8,43.6 35.8,41.8 37.8,41.8
  pour Top: 10.2,6.7 12.2,6.7 12.3,8.9 10.2,8.9
  pour Top: 1.3,10 1.3,12.9 3.3,12.9 3.3,10
  pour Top: 9.8,15.3 11.7,15.3 11.7,17.5 9.3,17.5 9.3,15.3
  pour Top: 31.7,13.3 34.5,13.3 34.7,9.1 35.8,9.1 35.8,8.5 35.1,8.4 35.1,8.3 34.5,7.7 34.5,5 34.4,4.9 31.5,4.9 31.4,5 31.4,8.6
  pour Top: 23.6,12.6 23.6,10.9 26,11 26,13 23.9,13 23.7,12.8
  pour Top: 32.1,11.9 34.5,11.9 34.5,14.6 35.1,15.4 35.8,15.4 35.9,15.5 35.9,16 32,16 32,15.5 31.9,12.1
  pour Bottom: 16,14.6 16.9,14.6 17.2,14.9 20.3,14.9 20.4,15 20.4,17.4 20.3,17.5 18.1,17.5 17.3,16.7 16.7,16.1 16.3,16.1 16,15.8
  pour Top: 13.4,34.1 15.7,34.1 16.1,34.5 16.1,41.6 13.8,43.9 8.7,43.9 8.3,43.5 8.3,40.5 9,39.8 11.6,39.8 11.8,39.6 11.8,38.3 11.9,38.2 13.3,38.2 13.7,37.8 13.7,36.2 13.3,35.8 13.3,34.2
IR_PWR_CMD  (via drill 0.38)
  Top 0.25: UC1.P$40 34.6,23.5 v34.9,23.1
  Bottom 0.25: v34.9,23.1 32.7,23.1 32.6,23.2 31.8,23.2 31.4,22.8 31.4,21.4 30.9,20.9 29.9,20.9 27.1,18.1 24.5,18.1 22.8,16.4 22.7,16.4 20.3,14 18.36,14 R21.1 18.18,14.18 M1.P$4
IRVDD  (via drill 0.6, 0.7)
  Top 0.25: R53.2 74.4,49.9 74.9,50.4 74.9,59.5 74.3,60.1 72.56,60.1 J2.P$4
  Top 0.51: v21.9,17.4 21.6,17.1 21.6,13.2 v21.5,13.1 | J2.P$4 69.47,58.93 68.3,60.1 66.05,60.1 J1.P$4 64.79,59.61 63.5,60.9 63.5,71.3 60.7,74.1 42.7,74.1 41.85,73.25 | 41.85,73.25 41.7,73.1 J6.P$18 | 41.85,73.25 28,73.25 J4.P$6 | v16.8,29.7 16.8,43.2 16.2,43.8 v16.2,43.9
  Bottom 0.51: J5.P$2 8.71,23.31 M2.5 M2.6 | M2.6 M2.7 M2.8 18.2,21.64 18.2,19.9 19.5,18.6 21.4,18.6 21.8,18.2 21.8,17.6 21.9,17.5 v21.9,17.4 | v21.5,13.1 21.6,13 24.4,13 27,10.4 27,9 29.6,6.4 29.6,5.4 30.8,4.2 38.4,4.2 39.1,4.9 43.9,4.9 44.5,4.3 46.6,4.3 48.3,6 J3.P$4 | M2.6 13.98,26.79 16.7,29.5 16.7,29.6 v16.8,29.7 | J4.P$6 24.89,70.81 23.5,72.2 17,72.2 15.7,70.9 15.7,64 11,59.3 8.2,59.3 5.5,56.6 5.5,48.9 6.1,48.3 11.8,48.3 v16.2,43.9
L1_DISG
  Top 0.2: J7.P$18 44,49.9 44,48.4 41,45.4 41,39 39.3,37.3 39.3,32.9 39.5,32.7 UC1.P$60
L1_REF
  Top 0.2: UC1.P$4 37.11,37.01 37.9,37.8 37.9,39.7 39.2,41 39.2,45.9 40.9,47.6 40.9,49 J7.P$20
L1_RUN_CHG
  Top 0.2: J7.P$17 41.8,50.1 41.8,47.7 39.7,45.6 39.7,40.8 38.4,39.5 38.4,37.7 38.11,37.41 UC1.P$2
L1_TEMP
  Top 0.2: J7.P$1 44.5,54.8 44.5,59.7 43.38,60.83 U8.P$4
L2_DISG
  Top 0.2: UC1.P$1 | J7.P$19 42.8,48 40.4,45.6 40.4,39.1 38.6,37.3 UC1.P$1
L2_REF  (via drill 0.38)
  Top 0.2: UC1.P$16 31.1,37.2 30.6,37.7 v30.6,46.3
  Bottom 0.2: J7.P$8 29.8,52.1 29.8,47.1 v30.6,46.3
L2_RUN_CHG
  Top 0.2: 39.65,50.25 39.8,50.1 | 39.65,50.25 J7.P$16 | UC1.P$5 36.61,37.11 37.4,37.9 37.4,39.9 38.7,41.2 38.7,46.8 39.8,47.9 39.8,50.1 | 39.8,50.1 39.65,50.25
L2_TEMP
  Top 0.2: U8.P$3 43.11,60.19 44,59.3 44,57.3 40.8,54.2 J7.P$2
LED1SNS  (via drill 0.38)
  Top 0.25: v42.6,45.9 42.6,36.2 41.1,34.7 UC1.P$64
  Bottom 0.25: J6.P$15 48.7,69.11 48.7,66.9 49.4,66.2 49.5,49.8 48.4,48.7 45.3,48.7 42.5,45.9 v42.6,45.9
LED1TEMP
  Top 0.2: J6.P$1 37.7,68 40.8,64.9 42.5,64.9 43.2,64.2 43.2,63.8 42.77,63.37 U8.P$8
LED2SNS  (via drill 0.38)
  Top 0.25: UC1.P$63 41.3,34.2 43.2,36.1 43.2,45.5 44.4,46.7 v44.5,46.7
  Bottom 0.25: J6.P$14 50.7,69.11 50.7,66 50,65.3 50,49.1 49,48.1 45.9,48.1 v44.5,46.7
LED2TEMP
  Top 0.2: U8.P$7 41.94,62.7 43.1,62.7 43.8,63.4 43.8,64.4 42.8,65.4 41.7,65.4 39.7,67.4 J6.P$2
LED3SNS  (via drill 0.38)
  Top 0.25: v44.1,45.1 44.1,44.8 43.8,44.5 43.8,36 41.4,33.6 40.46,33.6 UC1.P$62
  Bottom 0.25: J6.P$13 52.7,69.1 52.7,65.6 50.5,63.4 50.5,48.75 50.35,48.75 49.2,47.6 46.6,47.6 v44.1,45.1
LED3TEMP
  Top 0.2: U8.P$6 43.3,62.1 44.4,63.2 44.4,64.7 41.7,67.4 J6.P$3
LED4SNS  (via drill 0.38)
  Top 0.25: v45.8,43.7 45.7,43.7 44.4,42.4 44.4,36 41.6,33.2 UC1.P$61
  Bottom 0.25: J6.P$12 54.7,69.11 54.7,66.7 51.1,63.1 51.1,48.1 49.3,46.3 48.6,46.3 45.9,43.6 v45.8,43.7
LED4TEMP
  Top 0.2: U8.P$5 41.97,61.4 43.5,61.4 45,62.9 45,65 43.7,66.3 J6.P$4
LED_SHDN
  Top 0.25: U5.P$3 54.1,63.8 54.1,64.8 56.8,67.7 56.8,69.1 J6.P$11
  Bottom 0.25: J6.P$11 57.29,71.7 60.6,71.7 62.8,69.5 R58.1
LF1_TEMP
  Top 0.2: J7.P$3 43.5,57.8 43.5,58.9 42.84,59.55 U8.P$2
LF1REF
  Top 0.2: J7.P$25 30.8,47.6 31.3,47.1 31.3,37.6 31.61,37.29 UC1.P$15
LF2REF
  Top 0.2: J7.P$12 31.8,50.1 31.8,37.7 32.11,37.39 UC1.P$14
LF3_TEMP
  Top 0.2: J7.P$4 38.1,54.4 39.3,54.4 43,58.2 43,58.5 42.58,58.92 U8.P$1
LF3REF
  Top 0.2: J7.P$13 33.8,50.1 33.8,48.6 32.8,47.6 32.8,37.8 33.11,37.49 UC1.P$12
LF4REF
  Top 0.2: 32.61,48.91 J7.P$24 32.3,48.7 32.3,37.8 32.61,37.49 UC1.P$13
LF_B1_OUTEN
  Top 0.2: J7.P$15 36.8,51 37.8,50 37.8,48.5 36.1,46.8 34,46.8 33.6,46.4 33.6,38.2 34.61,37.19 UC1.P$9
LF_B1_RUNCHG
  Top 0.2: UC1.P$6 36.11,37.21 37,38.1 37,40.2 38.3,41.5 38.3,47.3 38.8,47.8 J7.P$21
LF_B2_OUTEN
  Top 0.2: J7.P$14 34.8,50.9 35.8,49.9 35.8,48.4 35.1,47.7 34.3,47.7 33.2,46.6 33.2,38 34.11,37.09 UC1.P$10
LF_B2_RUNCHG
  Top 0.2: J7.P$11 29.8,50.1 29.8,36.1 30.4,35.5 30.4,31.9 30.2,31.7 UC1.P$23
LFB1OSNS
  Top 0.2: J7.P$9 26.8,52.7 25.1,51 25.1,47.3 27.4,45 27.4,33.8 28,33.2 UC1.P$20
LFB1SNS
  Top 0.2: UC1.P$19 28.5,33.7 27.9,34.3 27.9,45.3 25.6,47.6 25.6,49.8 J7.P$10
LFB2OSNS
  Top 0.2: UC1.P$18 28.7,34.2 28.4,34.5 28.4,47.5 J7.P$27
LFB2SNS
  Top 0.2: UC1.P$17 29.36,48.54 J7.P$26
N$1
  Top 0.2: UC1.P$8 35.1,37.4 34.4,38.1 C8.1 34.42,39.02 C6.1 L1.2
N$2
  Top 0.25: C1.1 42.5,30.8 41.9,30.2 UC1.P$55
N$3
  Top 0.25: U1.P3 35.98,14.5 37.1,14.5 37.94,15.34 R3.1
N$4
  Top 0.25: U1.P7 29.2,13.2 28.29,14.11 R1.1
N$5
  Top 0.25: U12.P$4 16.03,8.07 15.8,8.3 15.8,11 L2.1
N$6
  Top 0.25: U12.P$2 17.03,8.23 17.2,8.4 17.2,11.3 L2.2
N$7
  Top 0.25: U13.P$4 6.61,36.71 6.4,36.5 4.58,36.5 L3.1
N$8
  Top 0.25: U13.P$2 6.59,37.71 6.4,37.9 3.9,37.9 3.6,37.6 3.53,37.67 L3.2
N$9
  Top 0.2: R9.1 14.7,3 C14.1 | C14.1 U12.P$6 | U12.P$7 16.03,2.69 C14.1 | U12.P$8 16.53,3.19 C14.1
N$10
  Top 0.25: R10.1 12.8,32 12.8,35.7 12.81,36.89 12.31,37 | 12.31,37 C15.1 arc-90 12.34,37.21 U13.P$8 | U13.P$7 11.82,36.71 arc90 12.31,37
N$11
  Top 0.25: C16.1 62.52,14.16 U15.10
N$12
  Top 0.25: U6.P3 R16.1
N$13
  Top 0.25: C20.1 21.41,20.03 U14.10
N$14
  Top 0.25: C17.2 63.5,12.19 63.5,15 62.4,16.3 61.6,16.3 61.1,15.8 61.1,15.4 60.86,15.16 U15.12
N$15
  Top 0.25: C17.1 60.01,11.26 U15.8
N$16
  Top 0.25: U6.P7 29.86,6.2 28.6,6.2 27.8,7 R14.1
N$17
  Bottom 0.25: U2.P$3 48.7,19.9 | 48.7,19.9 48.8,20 R17.2 | 48.7,19.9 48.6,20 R18.1
N$18
  Bottom 0.25: R19.2 44.12,11.18 44.7,10.6 46.8,10.6 47.4,11.2 47.4,12.1 U2.P$7
N$19
  Top 0.25: U10.P$3 28.28,62.08 28.7,62.5 R35.2 28.8,63.79 R34.2
N$20
  Top 0.25: R23.2 55.4,57.91 U5.P$7 | U5.P$6 54.08,57.16 R23.2 | C26.1 55.46,55.9 R23.2
N$21
  Top 0.25: 0,0 76.2,0 76.2,76.2 0,76.2 0,0
N$22
  Bottom 0.25: 14.78,15.16 14.72,15.34 | 14.78,15.16 M1.PAD | 14.72,15.34 14.6,15.7 M1.P$8 12.6,15.7 12.48,15.14 M1.P$7 14.75,15.18 arc-90 14.78,15.16 | 12.75,14.63 M1.P$6 14.6,14.68 arc90 M1.PAD | 12.48,14.12 M1.P$5 14.36,14.14 M1.PAD | M1.PAD 14.85,15.2 arc90 14.72,15.34
  pour Bottom: 12.4,13.4 15.3,13.4 15.6,13.7 15.6,15.9 15.2,16.3 13.7,16.3 13.2,16.8 13.2,19 13,19.2 9.9,19.2 9.8,19.1 9.8,18.1 9.9,18 11.3,18 11.9,17.4 11.9,13.9
N$23
  Top 0.25: C27.1 52.88,57.9 U5.P$5
N$24
  Top 0.25: R38.2 R40.1 R39.2
N$25
  Top 0.25: U10.P$4 24.6,62.49 R38.1 23.12,62.58 R37.2
N$26
  Route2 0.25: 57.5,12.6 57.5,16.2 61,16.2 61,12.6 57.5,12.6
N$27
  Top 0.25: R36.2 27.18,57.9 28.1,57.9 28.9,58.7 28.9,59.7 28.42,60.18 U10.P$1 27.02,60.18 26.3,60.9 26.3,63.41 R37.1
N$28
  Route3 0.25: 61,16.2 61,12.6 57.5,12.6 57.5,16.2 61,16.2
N$29
  Top 0.25: D7.A 72.6,44.6 R53.1
N$30
  Top 0.25: R54.1 D8.A
N$31
  Top 0.25: D9.A R55.1
N$33
  Top 0.25: U11.P$5 53.51,34.11 55.4,36 55.4,37.03 U11.P$1 56.5,38.13 D2.A
N$34
  Top 0.25: U11.P$3 54.1,37.15 54.1,37.7 53.41,38.39 R42.1 51.22,38.34 R43.2
N$35
  Route3 0.25: 19.3,25.3 23.2,25.3 23.2,21.6 19.3,21.6 19.3,25.3
N$36
  Route2 0.25: 19.3,25.3 23.2,25.3 23.2,21.6 19.3,21.6 19.3,25.3
N$37
  Bottom 0.25: 19.3,25.3 23.2,25.3 23.2,21.6 19.3,21.6 19.3,25.3
N$38
  Top 0.25: U11.P$6 54.2,32.84 54.2,32.3 R45.2 52.98,31.11 R44.2
N$39
  Bottom 0.25: 61,16.2 61,12.6 57.5,12.6 57.5,16.2 61,16.2
N$40
  Top 0.25: R56.1 49,61.1 D10.A
N$44  (via drill 0.38)
  Top 0.25: v61.2,66.7 62.1,67.6 D12.A
  Bottom 0.25: R58.2 61.9,66.7 v61.2,66.7
PD_FLASH  (via drill 0.38)
  Top 0.3: v61.3,61.7 63,60 63,54.8 60.4,52.2 57.3,52.2 56.3,51.2 U9.P$4
  Bottom 0.3: v61.3,61.7 61.3,61.8 60.8,62.3 60.8,63.01 J6.P$10
PD_IN
  Top 0.25: U11.P$2 54.81,38.07 D2.C 54.5,38.4 53.9,39 52.6,39 51.3,40.3 51.3,42.5 52.3,43.5 53.4,43.5 53.7,43.8 53.7,44.45 U9.P$9
PD_OUT  (via drill 0.38)
  Top 0.25: U11.P$7 R45.1 54.8,30.3 54.2,29.7 47.4,29.7 46.7,30.4 46.7,32.1 44.9,34 44.9,34.5 v44.6,35.1 | v37.6,33.8 UC1.P$3
  Bottom 0.25: v44.6,35.1 44.5,34.5 43.8,33.9 v37.6,33.8
PD_XN
  Top 0.3: J2.P$1 73.39,54.49 72.6,53.7 70.5,53.7 69.4,52.6 69.4,49.9 68,48.5 65.1,48.5 62.6,51 57.82,50.9 57.56,50.64 U9.P$2
PD_XP  (via drill 0.38)
  Top 0.3: v14.3,59 16.3,59 20.1,55.5 36.3,55.5 v36.7,55.1 | v17.8,35.2 v17.8,42.8 | v44.8,61.1 44.8,61 50.8,55 50.8,52.1 51.7,51.2 54.5,51.2 55,50.7 55,49.84 U9.P$6
  Route3 0.3: J5.P$1 8.1,20.6 9.2,21.7 9.2,28.1 10.8,29.7 12.3,29.7 v17.8,35.2
  Bottom 0.3: v17.8,42.8 17.8,44.1 11.6,50.3 11.6,56.9 13.9,59 v14.3,59 | v36.7,55.1 38.7,55.1 44.7,61.1 v44.8,61.1
PD_YN
  Top 0.3: U9.P$3 56.93,50.83 57.7,51.6 62.4,51.6 63.1,52.3 63.2,52.3 64.5,53.6 65.55,53.6 J1.P$1
PD_ZN
  Top 0.3: J4.P$5 26.03,67 35.3,67 36.4,68.1 36.4,68.7 36.8,69.1 44.2,69.1 44.7,68.6 44.7,66.2 45.9,65 45.9,60.9 51.6,55.2 51.6,52.3 52,51.9 54.7,51.9 55.66,50.94 U9.P$5
PD_ZP  (via drill 0.38)
  Top 0.3: J3.P$1 52.3,9.1 53,9.8 58.9,9.8 59.7,9 63.6,9 66.4,11.8 73,11.8 74.5,13.3 74.5,13.5 v74.6,13.6 | v72.5,47.9 64.1,47.9 62.2,49.9 58.29,49.9 U9.P$1
  Bottom 0.3: v74.6,13.6 74.6,45.9 v72.5,47.9
RAD_PWR_RUN
  Top 0.25: UC1.P$41 35.11,26.81 35.2,26.9 38.3,26.9 40.4,24.8 54.1,24.8 55.1,25.8 56.9,25.8 57.9,24.8 68.8,24.8 69.8,25.8 71.3,25.8 J8.P$7
RX_DATA  (via drill 0.38)
  Top 0.25: U3.P$4 63.52,23.93 R20.1 | UC1.P$46 37.62,22.08 38.6,21.1 42.5,21.1 45.4,24 61.07,24 R20.1 | R20.1 60.9,23.83 60.9,23.3 60.6,23 60.3,23 58.4,21.1 v58.3,21.1
  Route3 0.25: v58.3,21.1 64.6,27.4 v64.6,29.7
  Bottom 0.25: v64.6,29.7 64.4,30 V1.P$1
RX_EN
  Top 0.25: UC1.P$43 36.11,21.29 37.9,19.5 43.1,19.5 43.4,19.2 45.3,19.2 47.6,21.5 56.2,21.5 58.8,18.9 65,18.9 66.23,20.13 U3.P$1
RX_IN
  Top 0.25: R20.2 61.93,22.13 62.7,22.9 66.22,22.9 U3.P$2 68.69,22.89 70.6,24.8 72.3,24.8 J8.P$4
SCK  (via drill 0.38)
  Top 0.25: 28.14,16.29 U1.P6 30.52,14.47 30.9,14.1 30.9,10 30.5,9.6 29.2,9.6 28.6,9 28.6,7.9 29,7.5 29.86,7.5 U6.P6 | 28.14,16.29 R6.2 | 28.14,16.29 28.6,16.75 v28.6,18.3 | UC1.P$38 33.6,22 33.2,21.6 v33.2,20.8
  Bottom 0.25: v28.6,18.3 28.7,18.2 30.6,18.2 v33.2,20.8
SCL  (via drill 0.38, 0.6, 0.7)
  Top 0.25: U14.23 20.61,25.51 20.9,25.8 20.9,27.2 | 27.4,29.7 27.9,30.2 UC1.P$26 30.3,30.2 31.5,30.9 32.2,31.3 32.5,31.3 v32.4,31.4 | U15.1 56.55,15.16 56.54,15.17 | U8.P$15 38.85,59.55 40.1,60.8 40.1,63.6 v39.45,64.55 v36.6,66.4 | U9.P$15 57.6,44.54 57.6,45.9 58,46.3 v58,46.5 | v60.2,37.6 60.2,36.5 | 60.2,36.5 60.2,36.4 59.1,35.3 v58.8,35.3 | 60.2,36.5 61.2,37.5 70.6,37.5 V5.P$1
  Top 0.3: 23.7,69.1 26,69.1
  Top 0.51: J5.P$4 13.2,26.6 15,28.4 20.9,28.4 | 20.9,27.2 20.9,28.4 | 20.91,30.6 R7.1 | 20.91,30.6 20.91,28.41 20.9,28.4 | 27.4,29.7 21.81,29.7 20.91,30.6 | 56.54,15.17 50.37,15.17 50.3,15.1 50.2,15.1 v50,14.9 | J4.P$4 22.89,68.29 23.7,69.1 | 26,69.1 26.2,69.3 26.2,70.3 27.6,71.7 36.11,71.7 J6.P$20
  Route3 0.25: v54.8,26.7 v54.8,20.5
  Route3 0.3: 5.1,25.6 7.1,25.6
  Route3 0.51: J3.P$3 48.2,8.2 47.2,7.2 47.2,5.6 44.4,2.8 16.5,2.8 15.5,3.8 15.5,12.6 12.7,15.4 9,15.4 8.2,14.6 5.5,14.6 4.2,15.9 4.2,24.8 5.1,25.6 | 7.1,25.6 J5.P$4
  Bottom 0.25: v32.4,31.4 33.2,32.2 34.2,32.2 35.7,33.7 36.4,33.7 37.1,34.4 37.1,37.6 34.8,40.1 J7.P$23 | v58,46.5 58.1,46.4 58.1,39.7 v60.2,37.6 | v58.8,35.3 58.8,30 59.9,28.9 59.9,28.3 58.7,27.1 58.7,26 58.5,25.8 57.97,25.8 U7.P$1 57.94,26.06 57.4,26.6 55.1,26.6 55,26.7 v54.8,26.7 | v54.8,20.5 54.8,19.7 v50,14.9
  Bottom 0.3: 68.5,57.9 72.4,57.9 | J7.P$23 34.7,49.1 33.8,50.1 33.8,54.3 39.5,60.1 39.5,63.5 39.45,63.55 v39.45,64.55
  Bottom 0.51: J3.P$3 48.7,8.61 U2.P$6 48.7,13.61 v50,14.9 | J2.P$2 73.37,56.93 72.4,57.9 | J1.P$2 67.85,57.9 68.5,57.9 68.5,50.6 66,48.4 62.4,48.4 60.9,47 58.5,47 v58,46.5 | J6.P$20 37.31,70.11 36.5,69.3 36.5,67.2 v36.6,66.4 36.5,66.4
SDA  (via drill 0.6, 0.7)
  Top 0.25: U14.24 20.2,26 | UC1.P$25 23.92,30.7 v23.81,30.81 | 58.5,17.2 U15.16 | U8.P$14 38.69,60.19 39.5,61 39.5,63 38.6,63.9 38.1,63.9 37.6,64.4 37.6,64.6 v37.5,64.7 | J7.P$22 36.8,49.8 35.8,50.8 35.8,51.7 35.4,52.1 28.1,52.1 27.8,52.4 27.8,53.6 27.3,54.1 26.1,54.1 24.6,52.6 24.6,46.1 26.7,44 26.7,37.7 25.6,36.6 23.6,36.6 22.6,35.6 22.6,33.1 23.59,32.11 R8.1 | v56.8,47.4 56.93,47.27 U9.P$14
  Top 0.3: 5.1,25.6 7,25.6
  Top 0.51: 20.2,26 19.4,26.8 v19.1,26.8 15.5,26.8 13.3,24.6 J5.P$3 7,25.6 | R8.1 v23.81,30.81 v23.8,30.8 | v56.9,17.5 58.2,17.5 58.5,17.2 | v5,28 5,27.9 4.2,27.1 4.2,26.5 5.1,25.6
  Route3 0.3: 21.8,69.1 25.9,69.1 | 49.3,7.4 49.3,5.8 45.1,1.6
  Route3 0.51: v44.9,72.9 42.49,72.9 J6.P$19 38.11,71.7 27.6,71.7 26.2,70.3 26.2,69.4 25.9,69.1 | J4.P$3 20.89,68.19 21.8,69.1 | J3.P$2 50.1,8.2 49.3,7.4 | 45.1,1.6 16.3,1.6 14.5,3.4 14.5,12.2 12.5,14.2 10,14.2 9.2,13.4 4.7,13.4 2.4,15.7 2.4,26.5 3.5,26.5 v5,28
  Bottom 0.25: 60.5,35.5 61.6,34.4 61.6,28.7 60.5,27.6 60.1,27.6 59.4,26.9 59.4,25.6 58.9,25.1 57.96,25.1 U7.P$2 57.52,25.12 56.5,24.1 56.5,20.7 55.8,20 55.8,17.6 55.7,17.5 | 60.5,35.5 56.93,39.07 56.93,46.7 56.8,46.83 v56.8,47.4 | V4.P$1 71.2,39.7 69.6,38.1 63.1,38.1 60.5,35.5
  Bottom 0.3: 40.7,69.11 40.7,67 40.6,66.9 40.6,60.1 38.7,58.2 38.5,58.2 38,57.7 35.9,55.5 35.8,55.3 35.8,50.2 36.8,49.2 J7.P$22 | 65.75,57.8 63.7,57.8
  Bottom 0.51: v23.8,30.8 23.4,30.8 19.4,26.8 v19.1,26.8 | J3.P$2 49.98,8.53 U2.P$5 55.34,17.5 55.7,17.5 v56.9,17.5 | J2.P$3 73.39,59.01 72.5,59.9 72.5,60 67.95,60 J1.P$3 65.75,57.8 | 69.8,60 69.8,63.3 68.3,64.8 66.3,64.8 64.7,66.4 64.7,70 61.1,73.5 46,73.5 45.6,73.1 45.1,73.1 v44.9,72.9 | v37.5,64.7 38.4,64.7 40.7,67 | 40.7,69.11 J6.P$19 | 63.7,57.8 62,56.1 62,52.2 57.7,47.9 56.9,47.9 56.8,47.8 v56.8,47.4
SI  (via drill 0.38)
  Top 0.25: U6.P5 29.93,8.7 30.6,8.7 31.4,9.5 31.4,14.8 30.07,15.73 U1.P5 31.66,17.44 R5.1 31.36,17.44 30,18.8 v30,19.7 | v32.2,21.1 32.2,21.5 33.11,22.41 UC1.P$37
  Bottom 0.25: v30,19.7 30.8,19.7 v32.2,21.1
SO
  Top 0.25: U6.P2 35,7.09 35,8 35.2,8.2 36.9,8.2 37.1,8.4 37.1,9.7 35.1,11.7 35.1,13.5 | 35.1,13.5 35.4,13.21 U1.P2 | 35.1,13.5 35.1,14.7 35.5,15.1 36.4,15.1 37.1,15.8 37.1,16.1 35.75,17.45 R4.1 34.66,18.4 31.5,18.4 31.3,18.6 31.3,22.8 32.11,23.61 UC1.P$35
SWDCLK  (via drill 0.38, 0.6)
  Top 0.25: UC1.P$57 38.6,31.2 38.5,31.1
  Top 0.3: J9.P9 v15.9,55.1 v15.9,51.8 | 38.5,31.1 36.6,31.1 34.5,33.2 v34.1,33.2
  Bottom 0.3: J4.P$7 22.89,70.09 21.9,69.1 20.2,69.1 19.8,68.7 19.8,67.4 18.3,65.9 18.3,57.2 v15.9,55.1 | v34.1,33.2 33.3,34 33.3,35 16.3,51.9 16.1,52 v15.9,51.8
SWDIO  (via drill 0.38, 0.6)
  Top 0.25: UC1.P$58 38.8,31.7
  Top 0.3: J9.P10 15.26,56.36 15.5,56.6 v15.5,57.7 | 38.8,31.7 37.1,31.7 v34.4,34.4
  Bottom 0.3: J4.P$8 19.55,71.2 17.9,71.2 17.9,67 17.3,66.4 17.3,59.6 15.5,57.8 v15.5,57.7 15,57.3 15,54 20.7,48.9 34.4,35.5 v34.4,34.4
TEMP_IN
  Top 0.25: U8.P$9 33.31,63.37 R34.1 32.89,62.84 R41.2
TEMP_OUT  (via drill 0.38, 0.6)
  Top 0.2: UC1.P$11 33.61,35.49 33.8,35.3 35.2,35.3 v36,34.5
  Top 0.25: v24.4,56.4 25.2,57.72 R36.1 23.18,57.81 C32.1
  Bottom 0.25: v24.4,56.4 25.3,56 25.2,55.9 25.2,48 31.2,41.78 36,36.98 v36,34.5
TRIG
  Top 0.25: C28.2 58.81,62.9 D1.A | R24.2 58.77,63.08 D1.A | D1.A 58.01,63.01 57.3,62.3 55.6,62.3 55.3,62.6 55.3,63.73 U5.P$2
TX_DATA  (via drill 0.38)
  Top 0.25: UC1.P$45 37.11,21.59 38.2,20.5 42.8,20.5 45.3,23 v59.1,23 | v60.8,25.5 60.5,25.6 62.1,27.2 U4.P$2 67.09,27.19 68.4,28.5 V2.P$1
  Route3 0.25: v59.1,23 59.1,23.8 60.4,25.2 v60.8,25.5
TX_EN  (via drill 0.38)
  Top 0.25: U4.P$1 61.83,28.14 60.4,26.8 v60.2,26.6 | v57.9,22.3 45.5,22.3 43.2,20 38,20 36.6,21.4 UC1.P$44
  Route3 0.25: v60.2,26.6 60.2,26.1 57.9,23.8 57.9,22.1 57.7,21.9 v57.9,22.3
TX_OUT
  Top 0.25: J8.P$6 69.84,27.84 68.2,26.2 66.23,26.2 U4.P$4
VIN  (via drill 0.38, 2.8)
  Top 0.2: U12.P$5 15.5,7.78 15.5,8 15.1,8.6 14.6,8.6
  Top 0.25: U13.P$5 6.71,36.21 6.2,35.7
  Top 2.5: v3.5,58.8 3.46,58.84 R51.P$2
  Bottom 0.2: 69.7,18.7 69.7,19.3 70.2,19.8 71.3,19.8 J8.P$10
  Bottom 0.25: V3.P$1 3.2,48.9 3.3,48.8
  Bottom 2: v5.8,34.1 3.6,36.1 3.6,37.9 6.3,40.6 6.3,44.4
  Bottom 2.4: 16.7,1.8 55.9,1.9
  Bottom 2.5: 16.7,1.8 12,3.1 v12,11.2 8.2,11.2 2.8,16.6 2.8,30.5 5.8,33.5 v5.8,34.1 | 55.9,1.9 65.6,11.4 65.6,11.5 68,13.9 68,17 69.7,18.7 | 6.3,44.4 3.3,47.4 3.3,48.8 3.3,58.4 3.5,58.6 v3.5,58.8
  other vias: 10,12.2 11,12.2 12,12.2 13,12.2 10,11.2 11,11.2 13,11.2 13,10.2 12,10.2 11,10.2 4.8,33.1 5.8,33.1 6.8,33.1 6.8,34.1 5.8,35.1 6.8,35.1
  pour Top (rank 3): 12.6,4.3 13.6,4.3 14,4.7 14,6.3 14.7,7 15.5,7 15.9,6.9 15.8,8.9 15.5,8.9 13.8,10.3 13.8,13 12.4,14.4 7.9,14.4 7.5,14 7.5,11.1 7.6,11 9.6,11 11.7,8.9 12.4,8.9 12.6,8.7
  pour Bottom (rank 3): 13.7,10 13.7,12.8 9.5,12.8 9.5,10.9 10.9,9.6 13.3,9.6
  pour Bottom: 70.8,18.3 74.4,18.3 74.4,20.7 70.2,20.7 69.4,19.9 69.4,19.7
  pour Bottom: 3.9,32.5 7.4,32.5 7.5,32.6 7.5,35 7.1,35.4 4.4,35.4 3.9,34.9
  pour Top: 4.4,32.7 4.4,33.2 4.9,33.7 4.9,35.4 6.3,36.3 7.8,36.4 7.9,36.3 7.9,35.4 8.8,34.5 8.8,33.5 9.9,32.4 11,32.4 11.2,32.2 11.2,30.9 6.2,30.9
VIN-EXT
  pour Top (rank 6): 5.7,64.4 5.7,61.3 6.8,60.2 10.7,60.2 17.6,67.1 17.6,68.6 17.6,68.7 17.5,68.8 15.3,68.8 13.6,67.1 11.8,67.1 10.7,66 10.7,63.9 10,63.2 9.3,63.2 7.6,64.9 6.2,64.9
VIN-INT
  pour Top (rank 4): 6.4,23.1 2,23.1 1.3,22.4 1.3,13.7 1.9,13.1 2.5,13.1 4.2,11.4 6.7,11.4 6.7,22.9 6.5,23.1

## Text on the board
tPlace: -Z | FLASH | 3V3 | 5V | IRVDD | +X | -X | +Z
bPlace: -Z | +X | -X | +Z
tNames: ANT-DEP? | EQUiSAT: Control Board V3.0 / Brown Space Engineering / February 2017
bNames: EQUiSAT: Control Board V3.0 / Brown Space Engineering / February 2017